# Altium schematic sheet STM32-PROX_1.SchDoc
size 196 x 137 mm
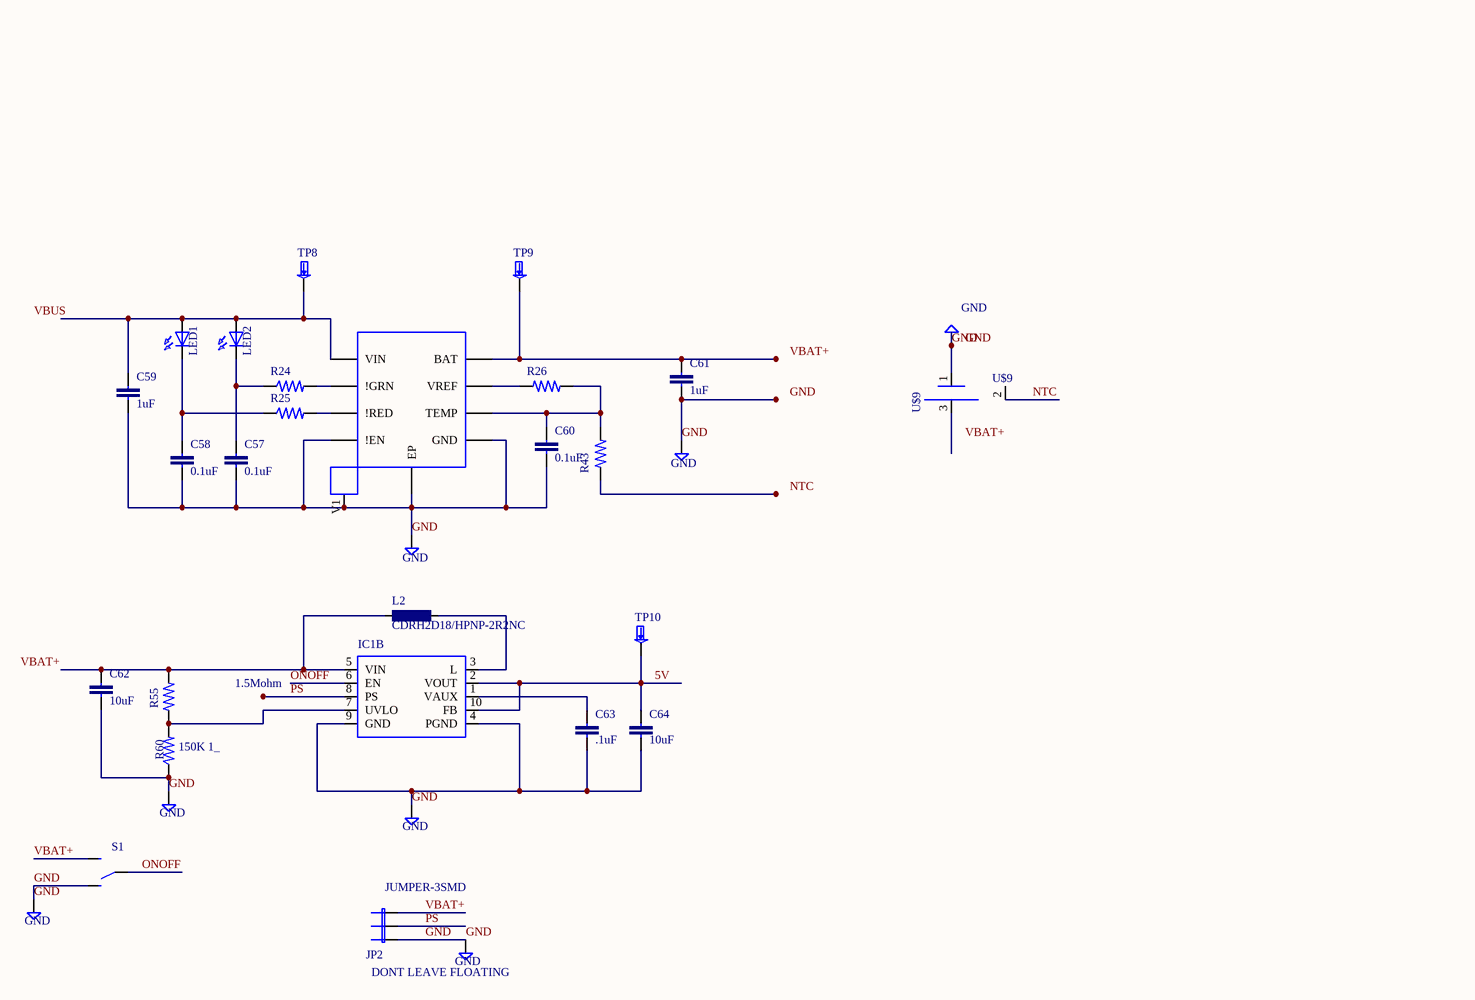
[diagram p0: STM32-PROX_1.SchDoc]

## Parts
C57  0.1uF  [SPARKFUN_0603-CAP]
C58  0.1uF  [SPARKFUN_0603-CAP]
C59  1uF  [SPARKFUN_0603-CAP]
C60  0.1uF  [SPARKFUN_0603-CAP]
C61  1uF  [SPARKFUN_0603-CAP]
C62  10uF  [SPARKFUN_0603-CAP]
C63  .1uF  [SPARKFUN_0603-CAP]
C64  10uF  [SPARKFUN_0603-CAP]
IC1  (no value)  [QFN-10]  (part B of 2)
JP2  JUMPER-3SMD  [SJ_3]
L2  CDRH2D18/HPNP-2R2NC  [CDRH2D18]
LED1  (no value)  [LED_SML0603]
LED2  (no value)  [LED_SML0603]
R24  (no value)  [RLC_0603]
R25  (no value)  [RLC_0603]
R26  (no value)  [RLC_0603]
R43  (no value)  [RLC_0603]
R55  1.5Mohm  [RLC_0603]
R60  150K 1_  [RLC_0603]
S1  (no value)  [SWITCH-SPST-SMD-A]
SUPPLY1  GND
SUPPLY2  GND
SUPPLY3  GND
SUPPLY4  GND
SUPPLY5  GND
SUPPLY6  GND
SUPPLY7  GND
TP8  (no value)  [--MERGED_KEYSTONE-SMD-TESTPOINT-5015]
TP9  (no value)  [--MERGED_KEYSTONE-SMD-TESTPOINT-5015]
TP10  (no value)  [--MERGED_KEYSTONE-SMD-TESTPOINT-5015]
U$7  (no value)  [UDFN-EP]  (parts A,B of 2)
U$9  (no value)  [BATT]

## Nets
5V: C64.1 IC1.2(VOUT) IC1.10(FB) TP10.1(P$1)
GND: C57.2 C58.2 C59.2 C60.2 C61.2 C62.2 C63.2 C64.2 IC1.4(PGND) IC1.9(GND) JP2.1 R60.1 S1.1(O) SUPPLY1.0(GND) SUPPLY2.0(GND) SUPPLY3.0(GND) SUPPLY4.0(GND) SUPPLY5.0(GND) SUPPLY6.0(GND) SUPPLY7.0(GND) U$7.4(!EN) U$7.5(GND) U$7.9(EP) U$7.V1 U$9.1(NEG)
NTC: U$9.2(NTC)
ONOFF: IC1.6(EN) S1.2(P)
PS: IC1.8(PS) JP2.2
VBAT+: JP2.3 S1.3(S)
NetC57_1: C57.1 C58.1 LED1.C LED2.C R24.1 R25.1
NetC59_1: C59.1 LED1.A LED2.A TP8.1(P$1) U$7.1(VIN)
NetC60_1: C60.1 R26.2 R43.2 U$7.6(TEMP)
NetC61_1: C61.1 TP9.1(P$1) U$7.8(BAT)
NetC62_1: C62.1 IC1.5(VIN) L2.P$1 R55.2
NetC63_1: C63.1 IC1.1(VAUX)
NetIC1_3: IC1.3(L) L2.P$2
NetIC1_7: IC1.7(UVLO) R55.1 R60.2
NetR24_2: R24.2 U$7.2(!GRN)
NetR25_2: R25.2 U$7.3(!RED)
NetR26_1: R26.1 U$7.7(VREF)

Not connected (* = marked no-connect by the designer): R43 1; U$9 3(POS)

## Notes on the sheet
- (near SUPPLY6) DONT LEAVE FLOATING
- Labels drawn without touching a wire or pin: GND, NTC, VBAT+, VBUS

## Library data of the parts
C57-C64 = SPARKFUN_CAP0603-CAP
IC1 = IC_TPS6120XQFN10
L2 = CDRH2D18
LED1 LED2 = LED_LEDSML0603
R24-R26 R43 R55 R60 = RESISTORRLC_0603
S1 = SWITCH-SPDT-SMD-A
TP8-TP10 = --MERGED_TESTPADKEYSTONE-SMD
U$7 = MC34674
U$9 = BATT